# EasyEDA Pro project ProDoc_PCB2_2025-12-04.epro

# Board PCB2
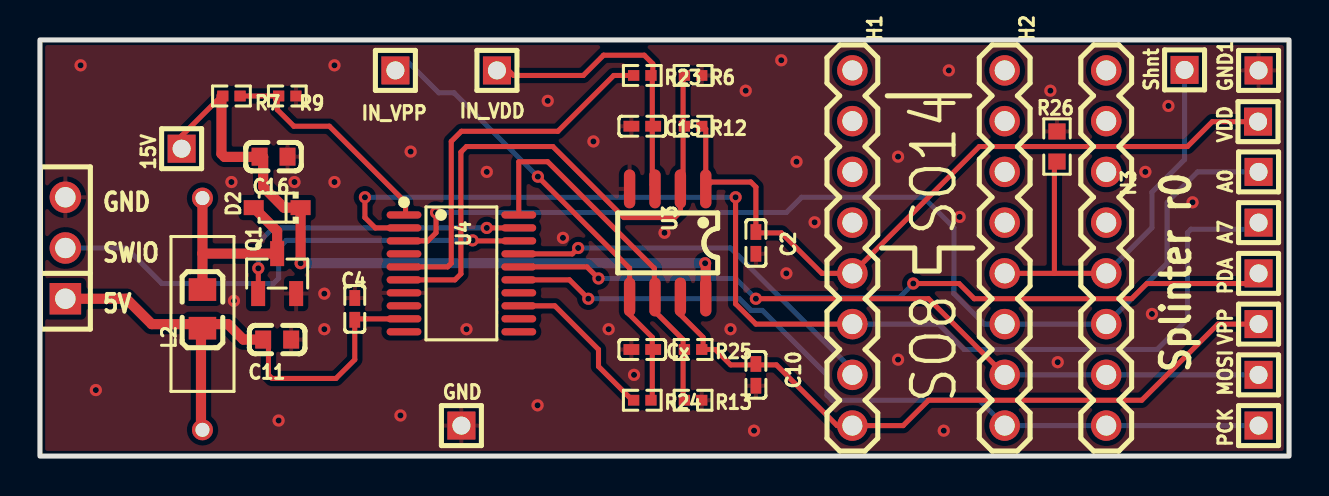
[diagram p0: board, top side]
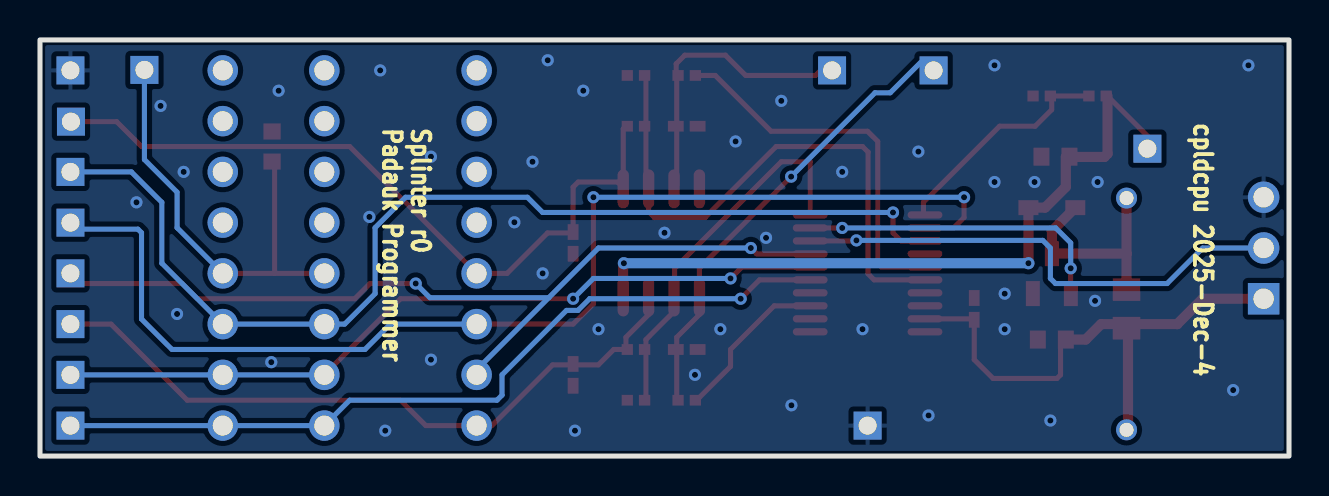
[diagram p1: board, bottom side, seen from below]

Outline 62.48 x 20.83 mm; copper layers: Top Layer, Bottom Layer. Coordinates in mm from the lower left corner of the outline.
Outline path: rectangle 0,20.83 62.48,0
Stack: Top Layer 0.035mm / Dielectric1 1.51mm FR4 er 4.5 / Bottom Layer 0.035mm

## Design rules (mm)
template: JLCPCB Capability(Two Layers Board)
spacing copperThickness1oz (default): track to track 0.102, other pairs 0.152 to 0.3
spacing copperThickness2oz: track to track 0.203, other pairs 0.152 to 0.3
track width copperThickness1oz (default): min 0.127, default 0.254, max 2.54
track width copperThickness2oz: min 0.203, default 0.254, max 2.54
differential pair differentialPair (default): width min 0.127, default 0.254, max 2.54; gap min 0.152, default 0.152
via viaSize (default): diameter min 0.5, default 0.61, max 10; hole min 0.3, default 0.305, max 6.3

## Placement (name value [footprint] x y rotation side)
15V  -  [HDR-TH_1P-V-M_XKB_X4611WV-01I-C28D40]  7.09 15.38 90 top
A0  -  [HDR-TH_1P-V-M_XKB_X4611WV-01I-C28D40]  60.96 14.22 90 top
A7  -  [HDR-TH_1P-V-M_XKB_X4611WV-01I-C28D40]  60.96 11.68 90 top
C2  100nF  [C0402]  35.81 10.67 90 top
C4  100nF  [C0402]  15.75 7.37 270 top
C10  100nF  [C0402]  35.81 4.06 90 top
C11  4.7uF  [C0603]  11.86 5.83 0 top
C15  100nF  [C0402]  30.13 16.51 180 top
C16  4.7uF  [C0603]  11.68 14.99 0 top
Cx  100nF  [C0402]  30.13 5.33 180 top
D2  1N5819WS  [SOD-323_L1.8-W1.3-LS2.5-RD]  11.86 12.43 180 top
GND  -  [HDR-TH_1P-V-M_XKB_X4611WV-01I-C28D40]  21.08 1.52 0 top
GND1  -  [HDR-TH_1P-V-M_XKB_X4611WV-01I-C28D40]  60.96 19.3 90 top
H1  IC IN OUT  [210S-1X8P]  40.64 10.41 270 top
H2  IC IN OUT  [210S-1X8P]  48.26 10.41 270 top
H3  IC IN OUT  [210S-1X8P]  53.34 10.41 270 top
H4  -  [HDR-TH_3P-P2.54-V-F]  1.27 10.41 90 top
IN_VDD  -  [HDR-TH_1P-V-M_XKB_X4611WV-01I-C28D40]  22.86 19.3 0 top
IN_VPP  -  [HDR-TH_1P-V-M_XKB_X4611WV-01I-C28D40]  17.78 19.3 0 top
L2  10uH  [L0805]  8.13 7.37 90 top
MOSI  -  [HDR-TH_1P-V-M_XKB_X4611WV-01I-C28D40]  60.96 4.06 90 top
PCK  -  [HDR-TH_1P-V-M_XKB_X4611WV-01I-C28D40]  60.96 1.52 90 top
PDA  -  [HDR-TH_1P-V-M_XKB_X4611WV-01I-C28D40]  60.96 9.14 90 top
Q1  2N7002  [SOT-23-3_L2.9-W1.3-P1.90-LS2.4-BR]  11.86 9.13 270 top
R6  20kΩ  [R0402]  32.67 19.05 0 top
R7  5.1kΩ  [R0402]  9.58 18.02 180 top
R9  1kΩ  [R0402]  12.37 18.02 0 top
R12  20kΩ  [R0402]  32.67 16.51 180 top
R13  20kΩ  [R0402]  32.67 5.33 180 top
R23  1kΩ  [R0402]  30.13 19.05 0 top
R24  1kΩ  [R0402]  30.13 2.79 0 top
R25  5.1kΩ  [R0402]  32.67 2.79 0 top
R26  1Ω  [R0603]  50.88 15.49 270 top
Shnt  -  [HDR-TH_1P-V-M_XKB_X4611WV-01I-C28D40]  57.26 19.33 90 top
U3  LM358DR2G  [SOIC-8_L5.0-W4.0-P1.27-LS6.0-BL]  31.4 10.67 180 top
U4  CH32V003F4P6  [TSSOP-20_L6.5-W4.4-P0.65-LS6.4-BL]  21.08 9.14 270 top
U5  10uH  [IND-TH_BD3.0-L7.6-P11.60-D0.5]  8.13 7.11 90 top
VDD  -  [HDR-TH_1P-V-M_XKB_X4611WV-01I-C28D40]  60.93 16.74 90 top
VPP  -  [HDR-TH_1P-V-M_XKB_X4611WV-01I-C28D40]  60.96 6.6 90 top

## Footprints (pads in the part's own frame, mm; a bottom-side part is the same pattern mirrored in y, then rotated)
210S-1X8P
  round 1.524 hole 1: 1(-8.89,0) 2(-6.35,0) 3(-3.81,0) 4(-1.27,0) 5(1.27,0) 6(3.81,0) 7(6.35,0) 8(8.89,0)
C0402
  rect 0.79x0.54 smd: 1(-0.545,0) 2(0.545,0)
C0603
  rect 0.8x0.9 smd: 1(-0.7,0) 2(0.7,0)
HDR-TH_1P-V-M_XKB_X4611WV-01I-C28D40
  rect 1.4x1.4 hole 0.9: 1(0,0)
HDR-TH_3P-P2.54-V-F
  rect 1.575x1.575 hole 1.02: 1(-2.54,0)
  round 1.575 hole 1.02: 2(0,0) 3(2.54,0)
IND-TH_BD3.0-L7.6-P11.60-D0.5
  round 1.05 hole 0.7: 1(-5.8,0) 2(5.8,0)
L0805
  rect 1.133x1.377 smd: 1(-0.966,0) 2(0.966,0)
R0402
  rect 0.566x0.54 smd: 1(-0.433,0) 2(0.433,0)
R0603
  rect 0.806x0.864 smd: 1(-0.753,0) 2(0.753,0)
SOD-323_L1.8-W1.3-LS2.5-RD
  rect 1x0.75 smd: 1(-1.173,0) 2(1.173,0)
SOIC-8_L5.0-W4.0-P1.27-LS6.0-BL
  oval 0.569x1.95 smd: 1(-1.905,-2.705) 2(-0.635,-2.705) 3(0.635,-2.705) 4(1.905,-2.705) 5(1.905,2.705) 6(0.635,2.705) 7(-0.635,2.705) 8(-1.905,2.705)
SOT-23-3_L2.9-W1.3-P1.90-LS2.4-BR
  rect 1.25x0.7 smd: 1(1,-0.95) 2(1,0.95) 3(-1,0)
TSSOP-20_L6.5-W4.4-P0.65-LS6.4-BL
  oval 0.364x1.742 smd: 1(-2.925,-2.871) 2(-2.275,-2.871) 3(-1.625,-2.871) 4(-0.975,-2.871) 5(-0.325,-2.871) 6(0.325,-2.871) 7(0.975,-2.871) 8(1.625,-2.871) 9(2.275,-2.871) 10(2.925,-2.871) 11(2.925,2.871) 12(2.275,2.871) 13(1.625,2.871) 14(0.975,2.871) 15(0.325,2.871) 16(-0.325,2.871) 17(-0.975,2.871) 18(-1.625,2.871) 19(-2.275,2.871) 20(-2.925,2.871)

## Nets
15V: 15V.1 C16.1 D2.1 R7.2 U3.8
+5V: C4.2 C11.1 H4.1 L2.1 U4.9 U5.1
GND: C2.1 C4.1 C10.1 C11.2 C15.2 C16.2 Cx.2 GND.1 GND1.1 H4.3 Q1.2 R6.2 R9.2 R25.2 R26.1 U3.4 U4.7
DEV_ICVPP: C10.2 H1.8 R13.1 U3.7 VPP.1
DEV_VDD: C2.2 H1.5 R12.1 U3.1 VDD.1
ICPCK: H2.8 H3.8 PCK.1 U4.15
ICPDA_MISO: H1.7 PDA.1 U4.17
MOSI: H2.7 H3.7 MOSI.1 U4.16
PA0: A0.1 H2.6 H3.6 U4.3
PA7: A7.1 H1.6 U4.2
PWM_VDD: R23.1 U4.5
PWM_VPP: R24.1 U4.13
SENSE_BOOST: R7.1 R9.1 U4.1
SENSE_VDD: R6.1 R12.2 U3.2 U4.6
SENSE_VPP: R13.2 R25.1 U3.6 U4.20
SW: Q1.1 U4.19
SWIO: H4.2 U4.18
$1N21: D2.2 L2.2 Q1.3 U5.2
$1N24: C15.1 IN_VDD.1 R23.2 U3.3
$1N62: H2.5 H3.5 R26.2 Shnt.1
$1N3543: Cx.1 IN_VPP.1 R24.2 U3.5

Pads without a net: H1 1 2 3 4; H2 1 2 3 4; H3 1 2 3 4; U4 4 8 10 11 12 14

## Via types
v1: diameter 0.61, hole 0.305, Top Layer to Bottom Layer, 53 vias

## Routing (per net, layer and track width the routed paths; a pad name or vN(x,y) marks a point on that pad's centre or on a via; arc(x,y) is an arc through that point)
15V: length 37.1
  Top Layer w0.254: 9.08,18.02 7.09,16.03 15V.1
  Top Layer w0.508: v1(13.04,9.65) D2.1 12.2,12.43 11.16,13.47 11.16,14.97 9.23,14.97 9.08,15.13 9.08,18.02 ; 33.31,7.9 33.31,9.62 v1(33.27,9.65)
  Bottom Layer w0.508: v1(13.04,9.65) v1(33.27,9.65)
+5V: length 27.2
  Top Layer w0.254: 8.05,6.3 7.76,6.6 ; C11.1 11.43,5.57 11.43,4.06 11.61,3.88 14.81,3.88 15.75,4.83 15.75,6.87 18.21,6.87 U4.9
  Top Layer w0.508: C11.1 10.17,5.83 9.4,6.6 8.35,6.6 8.05,6.3 8.05,1.39 U5.1 ; 7.76,6.6 5.59,6.6 4.32,7.87 H4.1
GND:
  vias: v1(2.03,19.56) v1(2.79,3.3) v1(9.58,13.72) v1(9.7,7.77) v1(11.94,1.78) v1(12.73,13.72) v1(14.22,8.13) v1(14.22,6.35) v1(14.73,19.56) v1(14.73,13.72) v1(18.03,2.03) v1(18.54,15.24) v1(21.34,6.35) v1(22.35,14.22) v1(24.89,2.54) v1(25.4,17.78) v1(26.16,10.92) v1(27.69,15.75) v1(28.45,6.35) v1(29.72,4.06) v1(31.24,11.18) v1(34.54,6.35) v1(35.31,18.29) v1(35.72,1.27) v1(37.08,19.81) v1(37.34,9.14) v1(37.85,14.73) v1(38.75,11.7) v1(42.93,14.99) v1(42.93,4.83) v1(45.21,1.27) v1(45.47,19.3) v1(46.01,11.97) v1(50.55,18.29) v1(50.91,4.7) v1(55.3,14.22) v1(55.63,7.11) v1(56.45,17.53) v1(57.66,12.7)
DEV_ICVPP: length 34.5
  Top Layer w0.254: VPP.1 58.93,6.6 55.12,2.79 44.45,2.79 43.18,1.52 H1.8 39.88,1.52 36.84,4.56 34.55,4.56 33.78,5.33 33.17,5.33 33.17,5.95 32.04,7.08 32.04,7.9
DEV_VDD: length 37.3
  Top Layer w0.254: 33.17,16.51 33.31,16.38 33.31,13.44 33.58,13.72 35.56,13.72 35.81,13.46 35.81,11.17 37.09,11.17 39.12,9.14 H1.5 46.99,15.49 57.4,15.49 58.65,16.74 VDD.1
ICPCK: length 40.6
  Top Layer w0.254: 23.95,8.82 26.49,8.82 v1(27.43,7.87)
  Bottom Layer w0.254: v1(27.43,7.87) 34.99,7.87 35.57,7.29 36.14,7.29 39.37,4.06 39.37,3.05 39.62,2.79 46.99,2.79 H2.8 H3.8 PCK.1
ICPDA_MISO: length 44.7
  Top Layer w0.254: v1(26.92,10.41) 26.63,10.12 23.95,10.12 ; PDA.1 60.45,8.64 55.37,8.64 54.61,7.87 46.74,7.87 45.97,8.64 v1(43.69,8.64)
  Bottom Layer w0.254: 37.03,7.93 34.54,10.41 v1(26.92,10.41) ; 37.03,7.93 42.98,7.93 v1(43.69,8.64) ; 37.03,7.93 40.64,4.32 H1.7
MOSI: length 39.2
  Top Layer w0.254: v1(35.81,7.87) 44.45,7.87 H2.7 ; U4.16 27.36,9.47 v1(27.94,8.89)
  Bottom Layer w0.254: H2.7 H3.7 MOSI.1 ; v1(35.81,7.87) 34.8,8.89 v1(27.94,8.89)
PA0: length 53.8
  Top Layer w0.254: U4.3 19.41,10.77 19.81,11.18 v1(19.81,12.19)
  Bottom Layer w0.254: v1(19.81,12.19) 37.34,12.19 38.1,12.95 44.2,12.95 45.72,11.43 45.72,8.13 47.24,6.6 H2.6 H3.6 56.39,9.65 56.39,12.7 57.91,14.22 A0.1
PA7: length 59.3
  Top Layer w0.254: H1.6 35.81,6.6 34.8,7.62 v1(34.8,12.95) ; v1(16.26,12.95) 16.26,11.94 16.77,11.42 U4.2
  Bottom Layer w0.254: v1(16.26,12.95) v1(34.8,12.95) ; A7.1 60.63,11.36 57.58,11.36 57.4,11.18 57.4,6.86 55.88,5.33 46.23,5.33 44.96,6.6 H1.6
PWM_VDD: length 19
  Top Layer w0.254: 29.63,19.05 28.7,19.05 25.91,16.26 21.08,16.26 20.57,15.75 20.57,9.65 20.39,9.47 U4.5
PWM_VPP: length 8.1
  Top Layer w0.254: U4.13 25.76,7.52 27.94,5.33 27.94,4.48 29.63,2.79
SENSE_BOOST: length 11.5
  Top Layer w0.254: U4.1 18.29,12.15 18.29,12.7 14.48,16.51 12.7,16.51 11.87,17.34 11.87,18.02 10.08,18.02
SENSE_VDD: length 28.6
  Top Layer w0.254: 32.17,16.51 32.17,13.58 32.04,13.44 32.04,12.22 31.75,11.94 29.21,11.94 25.65,15.49 21.34,15.49 21.06,15.22 21.06,9.12 20.76,8.82 18.21,8.82 ; 32.17,16.51 32.17,19.05
SENSE_VPP: length 18.9
  Top Layer w0.254: 32.17,5.33 32.17,5.83 30.77,7.23 30.77,7.9 30.73,7.93 30.73,9.4 25.4,14.73 23.95,14.73 U4.20 ; 32.17,5.33 32.17,2.79
SW: length 15.9
  Top Layer w0.254: U4.19 v1(22.35,11.42) ; v1(10.92,9.4) 10.92,8.14 10.92,8.13
  Bottom Layer w0.254: v1(10.92,9.4) 10.92,10.67 11.67,11.42 v1(22.35,11.42)
SWIO: length 25.2
  Top Layer w0.254: v1(21.64,10.8) 21.67,10.77 U4.18
  Bottom Layer w0.254: H4.2 4.32,10.41 6.1,8.64 11.68,8.64 11.94,8.89 11.94,10.41 12.32,10.8 v1(21.64,10.8)
$1N21: length 11.2
  Top Layer w0.508: U5.2 8.13,10.13 ; 8.13,10.13 Q1.3 11.86,11.26 D2.2 ; 8.13,10.13 8.13,8.81 8.29,8.64 8.05,8.4
$1N24: length 14.4
  Top Layer w0.254: 23.29,19.45 23.69,19.05 27.18,19.05 28.19,20.07 30.23,20.07 30.66,19.63 30.66,19.08 30.63,19.05 30.63,16.51 ; 30.63,16.51 30.63,13.58 30.77,13.44
$1N62: length 22.5
  Top Layer w0.254: R26.2 50.75,14.61 50.75,9.14 ; H2.5 50.75,9.14 ; 50.75,9.14 H3.5
  Bottom Layer w0.254: H3.5 55.63,11.43 55.63,13.21 57.26,14.84 Shnt.1
$1N3543: length 22.4
  Top Layer w0.254: 30.63,5.33 30.63,5.95 29.5,7.08 29.5,9.4 v1(24.91,13.99) ; 30.63,5.33 30.63,2.79
  Bottom Layer w0.254: 18.42,19.71 19.95,18.18 20.71,18.18 v1(24.91,13.99)

## Copper pours and planes (outline as drawn; the poured copper is in the pictures)
GND on Top Layer: -2.54,23.37 65.02,23.37 65.02,-3.3 -2.54,-3.3
GND on Bottom Layer: -4.09,25.35 67.28,25.35 67.28,-5.89 -4.09,-5.89

## Text on the board
Bottom Silkscreen Layer: cpldcpu 2025-Dec-4 | Splinter r0 / Padauk Programmer
Top Silkscreen Layer: GND | SWIO | 5V | Splinter r0 | SO14 | SO8
